# EasyEDA Pro project ConeZ-v0_1.eprj, schematic Schematic1
Board Name: Board1; Create Date: 2025-06-20; Page Name: P1; Project Name: ConeZ-12V; Schematic Name: Schematic1; Update Date: 2025-06-19; Company: EasyEDA.com; Page Size: A4; Version: V1.0
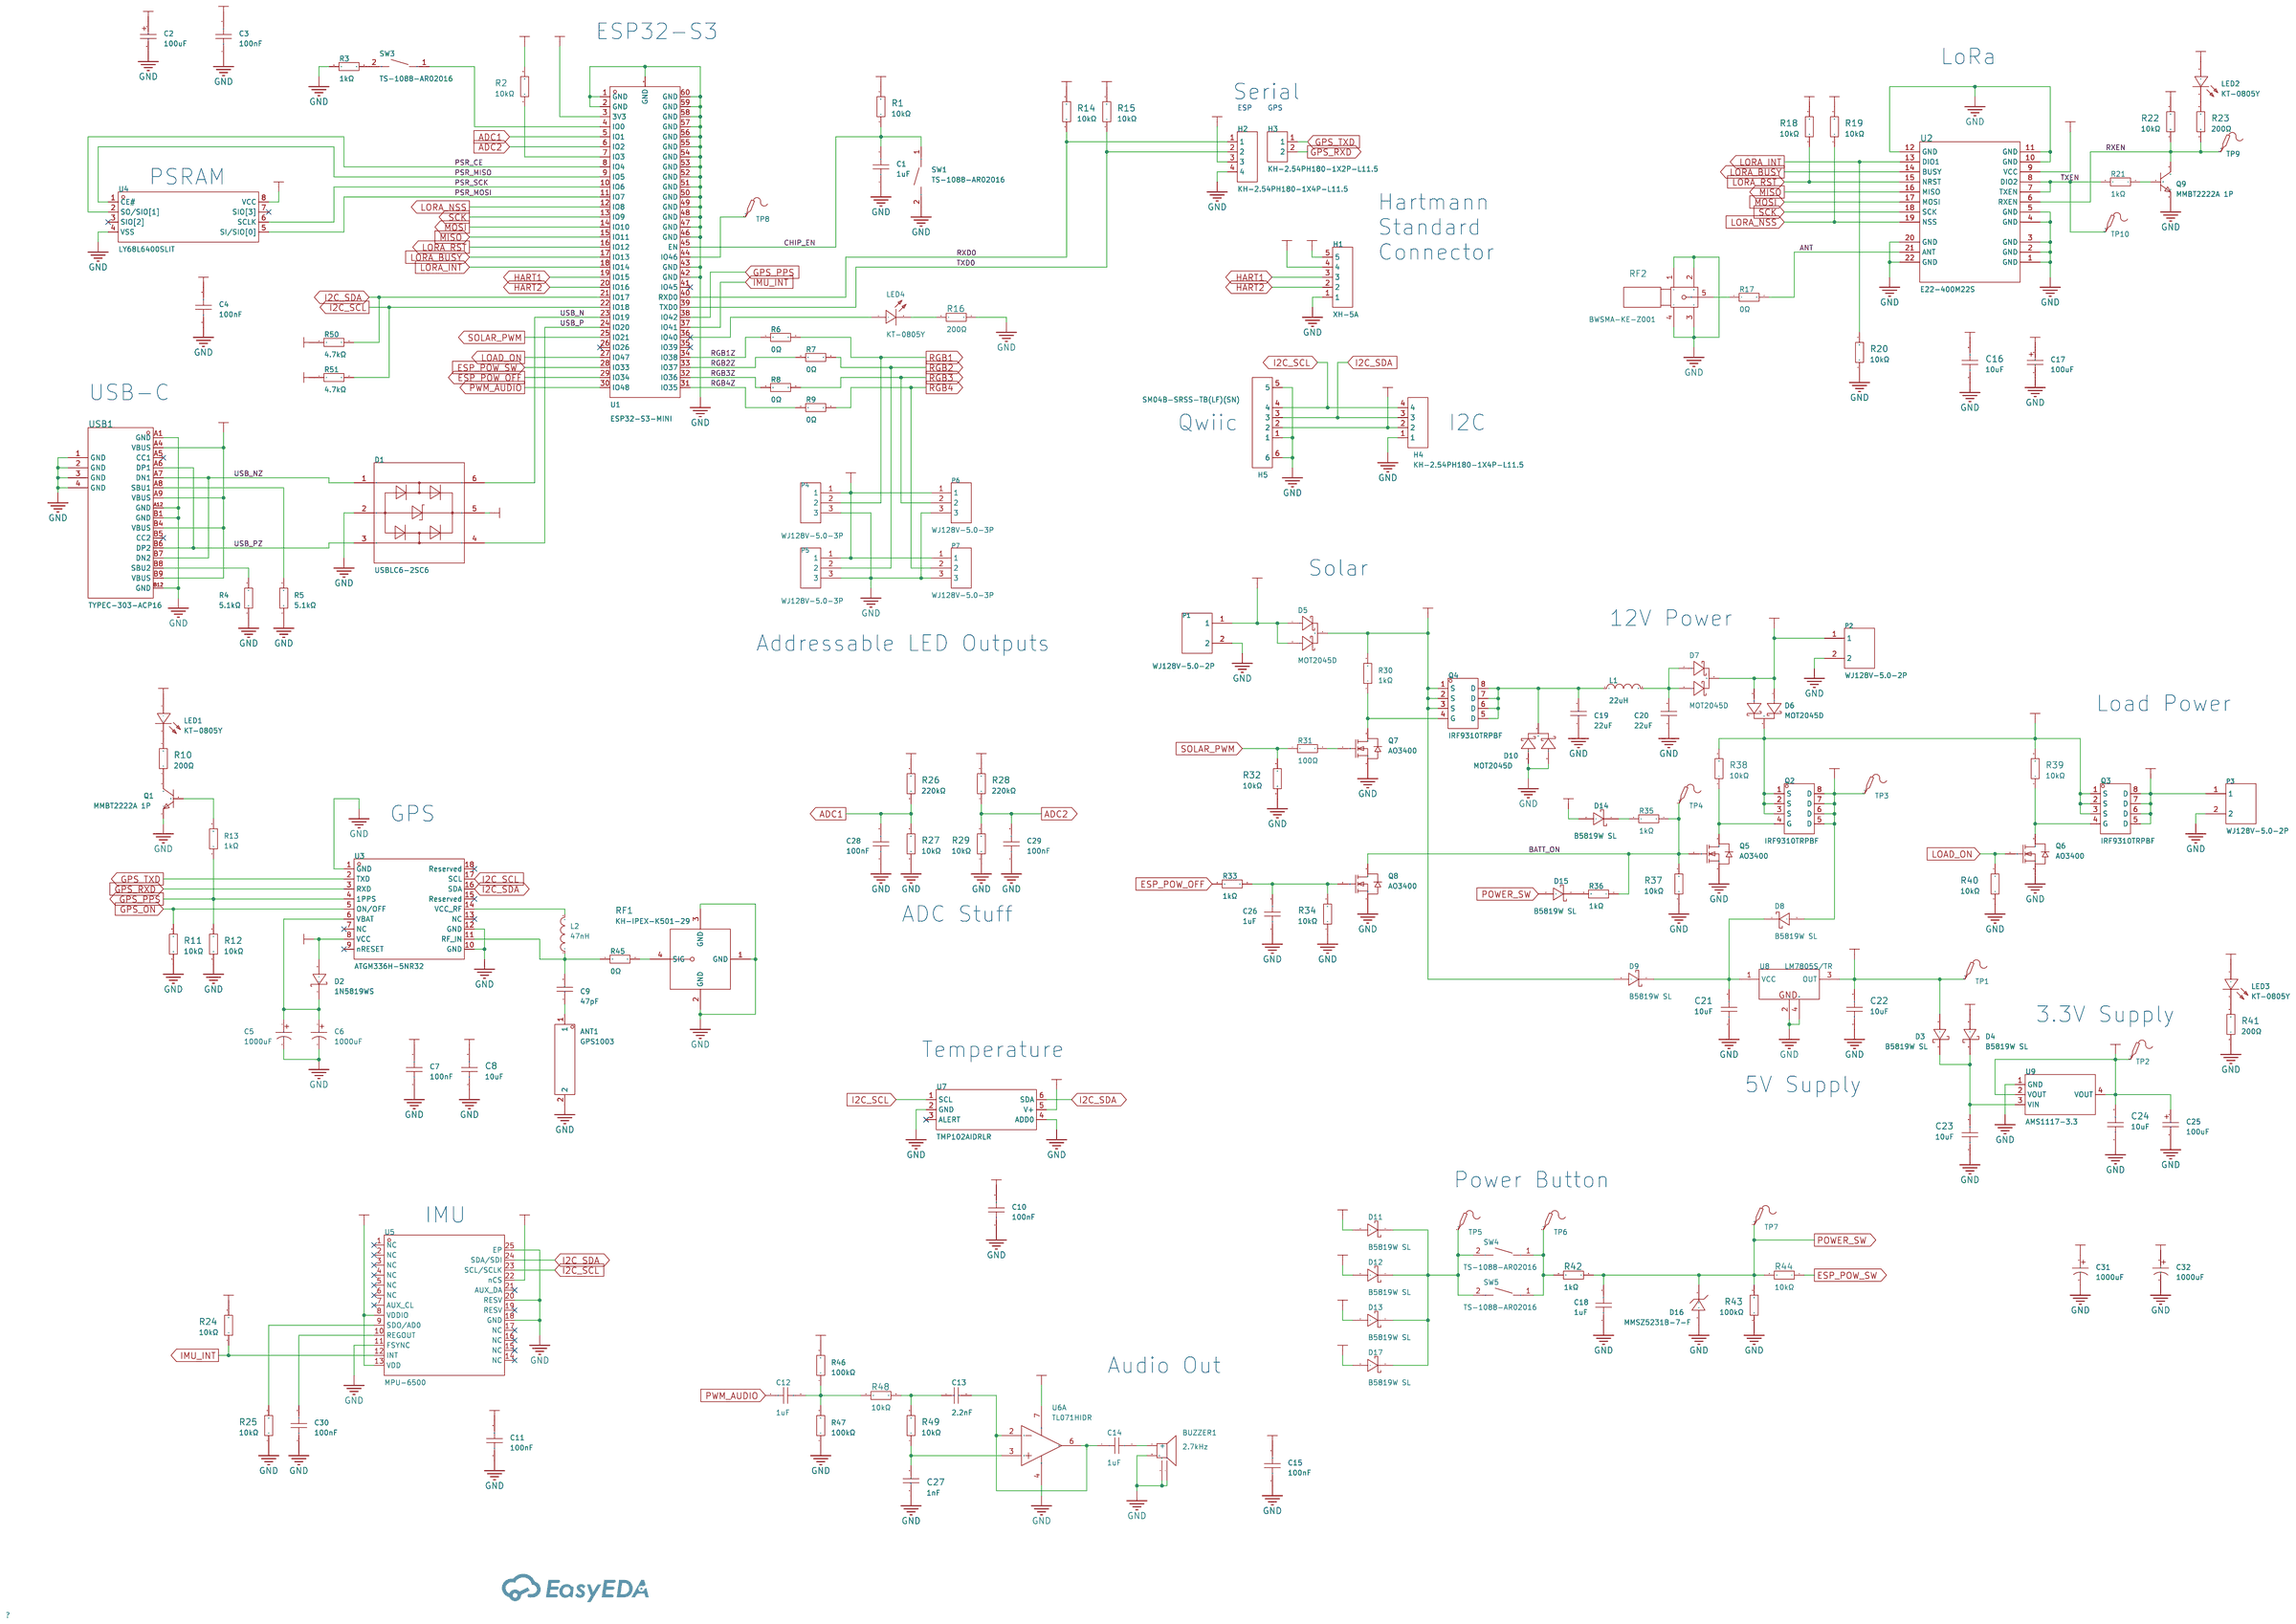
[diagram p0: schematic sheet]

## Parts
ANT1  GPS1003  [ANT-SMD_L10.0-W3.0]
BUZZER1  2.7kHz  [BUZ-SMD_4P-L8.5-W8.5-P8.50-BR]
C1  1uF  [C0603]
C2  100uF  [CASE-B_3528]
C3  100nF  [C0603]
C4  100nF  [C0603]
C5  1000uF  [CAP-SMD_BD8.0-L8.3-W8.3-FD]
C6  1000uF  [CAP-SMD_BD8.0-L8.3-W8.3-FD]
C7  100nF  [C0603]
C8  10uF  [C0603]
C9  47pF  [C0603]
C10  100nF  [C0603]
C11  100nF  [C0603]
C12  1uF  [C0603]
C13  2.2nF  [C0603]
C14  1uF  [C0603]
C15  100nF  [C0603]
C16  10uF  [C0603]
C17  100uF  [CASE-B_3528]
C18  1uF  [C0603]
C19  22uF  [C1206]
C20  22uF  [C1206]
C21  10uF  [C0603]
C22  10uF  [C0603]
C23  10uF  [C0603]
C24  10uF  [C0603]
C25  100uF  [CASE-B_3528]
C26  1uF  [C0603]
C27  1nF  [C0603]
C28  100nF  [C0603]
C29  100nF  [C0603]
C30  100nF  [C0603]
C31  1000uF  [CAP-SMD_BD8.0-L8.3-W8.3-FD]
C32  1000uF  [CAP-SMD_BD8.0-L8.3-W8.3-FD]
D1  USBLC6-2SC6  [SOT-23-6_L2.9-W1.6-P0.95-LS2.8-BL]
D2  1N5819WS  [SOD-323_L1.8-W1.3-LS2.5-RD]
D3  B5819W SL  [SOD-123_L2.7-W1.6-LS3.7-RD-1]
D4  B5819W SL  [SOD-123_L2.7-W1.6-LS3.7-RD-1]
D5  MOT2045D  [TO-252-2_L6.6-W6.1-P4.57-LS10.0-BR-CW]
D6  MOT2045D  [TO-252-2_L6.6-W6.1-P4.57-LS10.0-BR-CW]
D7  MOT2045D  [TO-252-2_L6.6-W6.1-P4.57-LS10.0-BR-CW]
D8  B5819W SL  [SOD-123_L2.7-W1.6-LS3.7-RD-1]
D9  B5819W SL  [SOD-123_L2.7-W1.6-LS3.7-RD-1]
D10  MOT2045D  [TO-252-2_L6.6-W6.1-P4.57-LS10.0-BR-CW]
D11  B5819W SL  [SOD-123_L2.7-W1.6-LS3.7-RD-1]
D12  B5819W SL  [SOD-123_L2.7-W1.6-LS3.7-RD-1]
D13  B5819W SL  [SOD-123_L2.7-W1.6-LS3.7-RD-1]
D14  B5819W SL  [SOD-123_L2.7-W1.6-LS3.7-RD-1]
D15  B5819W SL  [SOD-123_L2.7-W1.6-LS3.7-RD-1]
D16  MMSZ5231B-7-F  [SOD-123_L2.8-W1.8-LS3.7-RD]
D17  B5819W SL  [SOD-123_L2.7-W1.6-LS3.7-RD-1]
H1  XH-5A  [CONN-TH_5P-P2.50_XH-5A_C2318]
H2  KH-2.54PH180-1X4P-L11.5  [HDR-TH_4P-P2.54-V-M]
H3  KH-2.54PH180-1X2P-L11.5  [HDR-TH_2P-P2.54-V-M]
H4  KH-2.54PH180-1X4P-L11.5  [HDR-TH_4P-P2.54-V-M]
H5  SM04B-SRSS-TB(LF)(SN)  [CONN-SMD_4P-P1.00_SM04B-SRSS-TB-LF-SN]
L1  22uH  [IND-SMD_L17.5-W17.0_YXMAC1770]
L2  47nH  [L0603]
LED1  KT-0805Y  [LED0805-R-RD]
LED2  KT-0805Y  [LED0805-R-RD]
LED3  KT-0805Y  [LED0805-R-RD]
LED4  KT-0805Y  [LED0805-R-RD]
P1  WJ128V-5.0-2P  [CONN-TH_2P-P5.00_WJ128V-5.0-2P]
P2  WJ128V-5.0-2P  [CONN-TH_2P-P5.00_WJ128V-5.0-2P]
P3  WJ128V-5.0-2P  [CONN-TH_2P-P5.00_WJ128V-5.0-2P]
P4  WJ128V-5.0-3P  [CONN-TH_3P-P5.00_WJ128V-5.0-3P]
P5  WJ128V-5.0-3P  [CONN-TH_3P-P5.00_WJ128V-5.0-3P]
P6  WJ128V-5.0-3P  [CONN-TH_3P-P5.00_WJ128V-5.0-3P]
P7  WJ128V-5.0-3P  [CONN-TH_3P-P5.00_WJ128V-5.0-3P]
Q1  MMBT2222A 1P  [SOT-23-3_L2.9-W1.3-P1.90-LS2.4-BR]
Q2  IRF9310TRPBF  [SOIC-8_L4.9-W3.9-P1.27-LS6.0-BL]
Q3  IRF9310TRPBF  [SOIC-8_L4.9-W3.9-P1.27-LS6.0-BL]
Q4  IRF9310TRPBF  [SOIC-8_L4.9-W3.9-P1.27-LS6.0-BL]
Q5  AO3400  [SOT-23_L2.9-W1.3-P1.90-LS2.4-BR]
Q6  AO3400  [SOT-23_L2.9-W1.3-P1.90-LS2.4-BR]
Q7  AO3400  [SOT-23_L2.9-W1.3-P1.90-LS2.4-BR]
Q8  AO3400  [SOT-23_L2.9-W1.3-P1.90-LS2.4-BR]
Q9  MMBT2222A 1P  [SOT-23-3_L2.9-W1.3-P1.90-LS2.4-BR]
R1  10kΩ  [R0603]
R2  10kΩ  [R0603]
R3  1kΩ  [R0603]
R4  5.1kΩ  [R0603]
R5  5.1kΩ  [R0603]
R6  0Ω  [R0603]
R7  0Ω  [R0603]
R8  0Ω  [R0603]
R9  0Ω  [R0603]
R10  200Ω  [R0603]
R11  10kΩ  [R0603]
R12  10kΩ  [R0603]
R13  1kΩ  [R0603]
R14  10kΩ  [R0603]
R15  10kΩ  [R0603]
R16  200Ω  [R0603]
R17  0Ω  [R0603]
R18  10kΩ  [R0603]
R19  10kΩ  [R0603]
R20  10kΩ  [R0603]
R21  1kΩ  [R0603]
R22  10kΩ  [R0603]
R23  200Ω  [R0603]
R24  10kΩ  [R0603]
R25  10kΩ  [R0603]
R26  220kΩ  [R0603]
R27  10kΩ  [R0603]
R28  220kΩ  [R0603]
R29  10kΩ  [R0603]
R30  1kΩ  [R0603]
R31  100Ω  [R0603]
R32  10kΩ  [R0603]
R33  1kΩ  [R0603]
R34  10kΩ  [R0603]
R35  1kΩ  [R0603]
R36  1kΩ  [R0603]
R37  10kΩ  [R0603]
R38  10kΩ  [R0603]
R39  10kΩ  [R0603]
R40  10kΩ  [R0603]
R41  200Ω  [R0603]
R42  1kΩ  [R0603]
R43  100kΩ  [R0603]
R44  10kΩ  [R0603]
R45  0Ω  [R0603]
R46  100kΩ  [R0603]
R47  100kΩ  [R0603]
R48  10kΩ  [R0603]
R49  10kΩ  [R0603]
R50  4.7kΩ  [R0603]
R51  4.7kΩ  [R0603]
RF1  KH-IPEX-K501-29  [ANT-SMD_KH-IPEX-K501-29]
RF2  BWSMA-KE-Z001  [SMA-TH_BWSMA-KE-Z001]
SW1  TS-1088-AR02016  [SW-SMD_L3.9-W3.0-P4.45]
SW3  TS-1088-AR02016  [SW-SMD_L3.9-W3.0-P4.45]
SW4  TS-1088-AR02016  [SW-SMD_L3.9-W3.0-P4.45]
SW5  TS-1088-AR02016  [SW-SMD_L3.9-W3.0-P4.45]  (no BOM)
TP1  -  [Test-Point-0.5mm]
TP2  -  [Test-Point-0.5mm]
TP3  -  [Test-Point-0.5mm]
TP4  -  [Test-Point-0.5mm]
TP5  -  [Test-Point-0.5mm]
TP6  -  [Test-Point-0.5mm]
TP7  -  [Test-Point-0.5mm]
TP8  -  [Test-Point-0.5mm]
TP9  -  [Test-Point-0.5mm]
TP10  -  [Test-Point-0.5mm]
U1  ESP32-S3-MINI  [BULETM-SMD_ESP32-S3-MINI-1-N8]
U2  E22-400M22S  [WIRELM-SMD_E22-400M22S]
U3  ATGM336H-5NR32  [GPS-SMD_18P-L10.1-W9.7-P1.10-TL]
U4  LY68L6400SLIT  [SOP-8_L4.9-W3.9-P1.27-LS6.0-BL]
U5  MPU-6500  [QFN-24_L3.0-W3.0-P0.40-BL-EP]
U6  TL071HIDR  [SOIC-8_L4.9-W3.9-P1.27-LS6.0-BL]  (section 1)
U7  TMP102AIDRLR  [SOT-563_L1.6-W1.2-P0.50-LS1.6-BR]
U8  LM7805S/TR  [TO-263-3_L8.6-W10.2-P2.54-LS14.4-BR]
U9  AMS1117-3.3  [SOT-223-3_L6.5-W3.4-P2.30-LS7.0-BR]
USB1  TYPEC-303-ACP16  [USB-C-SMD_TYPEC-303-ACP16]

## Library data of the parts
ANT1 = GPS1003: Supplier Part: C239243; Manufacturer: rainsun(霖昱微); Supplier Footprint: SMD; JLCPCB Part Class: Extended Part; Datasheet: https://atta.szlcsc.com/upload/public/pdf/source/20180730/C239243_D9C604229B673F18F0675B95D946C54C.pdf; Supplier: LCSC
BUZZER1 = MLT-8530: Driver Circuitry:Passive (external drive) Technology:Electromagnetic Type Voltage - Supply:2.5V~4.5V Voltage - Supply:2.5V~4.5V Frequency:2.7kHz Sound Pressure Level(SPL):80dB Length:8.5mm Width:8.5mm Height:3.3mm; Supplier Part: C94599; Manufacturer: 华能; Supplier Footprint: SMD,8.5x8.5mm; JLCPCB Part Class: Extended Part; Datasheet: https://atta.szlcsc.com/upload/public/pdf/source/20170522/1495448322339.pdf; Supplier: LCSC; Driver Circuitry: Passive (external drive); Technology: Electromagnetic Type; Voltage - Supply: 2.5V~4.5V; Sound Pressure Level(SPL): 80dB; Length: 8.5mm; Width: 8.5mm; Height: 3.3mm
C1 C12 C14 C18 C26 = CL10A105KB8NNNC: Capacitance: Tolerance:±10% Tolerance:±10% Voltage Rated: Temperature Coefficient:; LCSC Part Name: 1uF ±10% 50V; Supplier Part: C15849; Manufacturer: SAMSUNG(三星); Supplier Footprint: 0603; JLCPCB Part Class: Basic Part; Datasheet: https://atta.szlcsc.com/upload/public/pdf/source/20160218/1457707763339.pdf; Supplier: LCSC; Tolerance: ±10%
C2 C17 C25 = TAJB107K006RNJ: LCSC Part Name: 100uF ±10% 6.3V; Supplier Part: C16133; Manufacturer: Kyocera AVX; Supplier Footprint: CASE-B-3528-21(mm); JLCPCB Part Class: Basic Part; Supplier: LCSC; Tolerance: ±10%; Voltage Rating: 6.3V; Equivalent Series Resistance(ESR): 1.7Ω@100kHz; Operating Temperature: -55℃~+125℃
C3 C4 C7 C10 C11 C15 C28-C30 = CC0603KRX7R9BB104: Capacitance:100nF Tolerance:±10% Tolerance:±10% Voltage Rating:50V Temperature Coefficient:X7R; LCSC Part Name: 100nF ±10% 50V; Supplier Part: C14663; Manufacturer: YAGEO(国巨); Supplier Footprint: 0603; JLCPCB Part Class: Basic Part; Datasheet: https://atta.szlcsc.com/upload/public/pdf/source/20180910/C282072_33301C7F631E79921B82A8DAC6BCC5B3.pdf; Supplier: LCSC; Tolerance: ±10%; Voltage Rating: 50V; Temperature Coefficient: X7R
C5 C6 C31 C32 = RVT0J102M0810: Capacitance:1000uF Tolerance:±20% Tolerance:±20% Voltage Rating:6.3V Ripple Current:- Equivalent Series Resistance(ESR):- Diameter:8mm Height - Seated (Max):10.2mm Lifetime:2000hrs@105℃ Operating Temperature:-55℃~+105℃ Operating Temperature:-55℃~+105℃; LCSC Part Name: 1000uF ±20% 6.3V; Supplier Part: C42851; Manufacturer: HONOR(荣誉); Supplier Footprint: SMD,D8xL10.5mm; JLCPCB Part Class: Extended Part; Datasheet: https://atta.szlcsc.com/upload/public/pdf/source/20250304/8AEF5A10740A8CC68A04B0B0B1D3A755.pdf; Supplier: LCSC; Tolerance: ±20%; Voltage Rating: 6.3V; Diameter: 8mm; Height - Seated (Max): 10.2mm; Lifetime: 2000hrs@105℃; Operating Temperature: -55℃~+105℃
C8 C16 C21-C24 = CL10A106MA8NRNC: Capacitance: Tolerance:±20% Tolerance:±20% Voltage Rated: Temperature Coefficient:; LCSC Part Name: 10uF ±20% 25V; Supplier Part: C96446; Manufacturer: SAMSUNG(三星); Supplier Footprint: 0603; JLCPCB Part Class: Basic Part; Datasheet: https://atta.szlcsc.com/upload/public/pdf/source/20160218/1457707763339.pdf; Supplier: LCSC; Tolerance: ±20%
C9 = CL10C470JB8NNNC: Capacitance: Tolerance:±5% Tolerance:±5% Voltage Rated: Temperature Coefficient:; LCSC Part Name: 47pF ±5% 50V; Supplier Part: C1671; Manufacturer: SAMSUNG(三星); Supplier Footprint: 0603; JLCPCB Part Class: Basic Part; Datasheet: https://atta.szlcsc.com/upload/public/pdf/source/20160218/1457707763339.pdf; Supplier: LCSC; Tolerance: ±5%
C13 = 0603B222K500NT: Capacitance:2200pF Tolerance:±10% Tolerance:±10% Voltage Rating:50V Temperature Coefficient:X7R; LCSC Part Name: 2.2nF ±10% 50V; Supplier Part: C1604; Manufacturer: FH(风华); Supplier Footprint: 0603; JLCPCB Part Class: Basic Part; Datasheet: https://atta.szlcsc.com/upload/public/pdf/source/20200305/C486355_26A10D38EF8C2A5C37091D0039909270.pdf; Supplier: LCSC; Tolerance: ±10%; Voltage Rating: 50V; Temperature Coefficient: X7R
C19 C20 = CL31A226KAHNNNE: LCSC Part Name: 22uF ±10% 25V; Supplier Part: C12891; Manufacturer: SAMSUNG(三星); Supplier Footprint: 1206; JLCPCB Part Class: Basic Part; Datasheet: https://atta.szlcsc.com/upload/public/pdf/source/20160218/1457707763339.pdf; Supplier: LCSC; Tolerance: ±10%
C27 = CL10B102KB8NNNC: Capacitance: Tolerance:±10% Tolerance:±10% Voltage Rated: Temperature Coefficient:; LCSC Part Name: 1nF ±10% 50V; Supplier Part: C1588; Manufacturer: SAMSUNG(三星); Supplier Footprint: 0603; JLCPCB Part Class: Basic Part; Datasheet: https://atta.szlcsc.com/upload/public/pdf/source/20160218/1457707763339.pdf; Supplier: LCSC; Tolerance: ±10%
D1 = USBLC6-2SC6_C7519: polarity:Unidirectional Reverse Stand-Off Voltage (Vrwm):5.25V Maximum Clamping Voltage:17V Peak Pulse Current (Ipp)@10/1000us:5A Breakdown Voltage:6V Number of Lines:双路 Operating Temperature:-40℃~+125℃@(Tj) Operating Temperature:-40℃~+125℃@(Tj) Type:ESD; LCSC Part Name: 单向ESD; Supplier Part: C7519; Manufacturer: ST(意法半导体); Supplier Footprint: SOT-23-6; JLCPCB Part Class: Extended Part; Datasheet: https://atta.szlcsc.com/upload/public/pdf/source/20140724/1457707160627.pdf; Supplier: LCSC; polarity: Unidirectional; Reverse Stand-Off Voltage (Vrwm): 5.25V; Maximum Clamping Voltage: 17V; Peak Pulse Current (Ipp)@10/1000us: 5A; Breakdown Voltage: 6V; Number of Lines: 双路; Operating Temperature: -40℃~+125℃@(Tj); Type: ESD
D2 = 1N5819WS_C191023: Forward Voltage (Vf@If):600mV@1A Reverse Voltage (Vr):40V Rectified Current:1A; LCSC Part Name: 电压:40V 电流:1A; Supplier Part: C191023; Manufacturer: Hottech(合科泰); Supplier Footprint: SOD-323; JLCPCB Part Class: Basic Part; Datasheet: https://atta.szlcsc.com/upload/public/pdf/source/20220428/3CB86FD8D28D653594B4E35F9D5AEFD9.pdf; Supplier: LCSC; Forward Voltage (Vf@If): 600mV@1A; Reverse Voltage (Vr): 40V; Rectified Current: 1A
D3 D4 D8 D9 D11-D15 D17 = B5819W SL: LCSC Part Name: 电压:40V 电流:1A; Supplier Part: C8598; Manufacturer: CJ(江苏长电/长晶); Supplier Footprint: SOD-123; JLCPCB Part Class: Basic Part; Datasheet: https://atta.szlcsc.com/upload/public/pdf/source/20171228/C164911_15144413243851213914.pdf; Supplier: LCSC; Forward Voltage (Vf@If): 600mV@1A; Reverse Voltage (Vr): 40V; Rectified Current: 1A
D5-D7 D10 = MOT2045D: LCSC Part Name: 电压:45V 电流:20A; Supplier Part: C5143091; Manufacturer: MOT(仁懋); Supplier Footprint: TO-252; JLCPCB Part Class: Extended Part; Datasheet: https://atta.szlcsc.com/upload/public/pdf/source/20240219/60133ED2FF76A65570CC4AEB79F23B07.pdf; Supplier: LCSC; Forward Voltage (Vf@If): 570mV@10A; Reverse Voltage (Vr): 45V; Rectified Current: 20A; Reverse Leakage Current (Ir): 50uA@45V
D16 = MMSZ5231B-7-F: Supplier Part: C85181; Manufacturer: DIODES(美台); Supplier Footprint: SOD-123; JLCPCB Part Class: Extended Part; Datasheet: https://atta.szlcsc.com/upload/public/pdf/source/20161024/1477288742621.pdf; Supplier: LCSC; Diode Configuration: Single; Zener Voltage (Nom): 5.1V; Reverse Leakage Current (Ir): 5uA@2V; Zener Voltage (Range): 4.85V~5.36V; Power Dissipation: 500mW; Zener Impedance (Zzt): 17Ω; Tolerance: ±5%
H1 = XH-5A_C2318: Pins Structure:1x5P Pitch:2.5mm Mounting Type:Direct Insert Reference Series:XH Number of Pins:5P Number of Rows:1 Number of PINs Per Row:5 Row Spacing:- Current Rating:- Contact Material:- Contact Plating:- Operating Temperature:- Operating Temperature:-; LCSC Part Name: 1x5P 间距:2.5mm 直插 系列:XH; Supplier Part: C2318; Manufacturer: BOOMELE(博穆精密); Supplier Footprint: 插件,P=2.5mm; JLCPCB Part Class: Extended Part; Datasheet: https://atta.szlcsc.com/upload/public/pdf/source/20151222/1457707654251.pdf; Supplier: LCSC; Pins Structure: 1x5P; Pitch: 2.5mm; Mounting Type: Direct Insert; Reference Series: XH; Number of Pins: 5P; Number of Rows: 1; Number of PINs Per Row: 5
H2 H4 = KH-2.54PH180-1X4P-L11.5: Pin Structure:1x4P Pitch:2.54mm Row Spacing:- Circluar Pins/Square Pins:Policy Mounting Type:Straight Number of Rows:Single Row Number of Pins:4P Current Rating:3A Voltage Rating (Max):- Length of Mating Pin:6mm Insulation Height:2.5mm Length of End Conne; LCSC Part Name: 1x4P 间距:2.54mm 方针 直插; Supplier Part: C2905435; Manufacturer: kinghelm(金航标); Supplier Footprint: 插件,P=2.54mm; JLCPCB Part Class: Extended Part; Datasheet: https://atta.szlcsc.com/upload/public/pdf/source/20211019/06FD9EA041E66F176E900F61FE678D35.pdf; Supplier: LCSC; Pin Structure: 1x4P; Pitch: 2.54mm; Circluar Pins/Square Pins: Policy; Mounting Type: Straight; Number of Rows: Single Row; Number of Pins: 4P; Current Rating: 3A; Length of Mating Pin: 6mm; Insulation Height: 2.5mm; Length of End Connection Pin: 3mm; Operating Temperature: -40℃~+105℃; Color: Black
H3 = KH-2.54PH180-1X2P-L11.5: Pin Structure:1x2P Pitch:2.54mm Row Spacing:- Circluar Pins/Square Pins:Policy Mounting Type:Straight Number of Rows:Single Row Number of Pins:2P Current Rating:3A Voltage Rating (Max):- Length of Mating Pin:6mm Insulation Height:2.5mm Length of End Conne; LCSC Part Name: 1x2P 间距:2.54mm 方针 直插; Supplier Part: C2905434; Manufacturer: kinghelm(金航标); Supplier Footprint: 插件,P=2.54mm; JLCPCB Part Class: Extended Part; Datasheet: https://atta.szlcsc.com/upload/public/pdf/source/20211019/75EAF9E0823F75B5BB441C07BAE9F5E6.pdf; Supplier: LCSC; Pin Structure: 1x2P; Pitch: 2.54mm; Circluar Pins/Square Pins: Policy; Mounting Type: Straight; Number of Rows: Single Row; Number of Pins: 2P; Current Rating: 3A; Length of Mating Pin: 6mm; Insulation Height: 2.5mm; Length of End Connection Pin: 3mm; Operating Temperature: -40℃~+105℃; Color: Black
H5 = SM04B-SRSS-TB(LF)(SN): Pins Structure:1x4P Pitch:1mm Mounting Style:Horizontal attachment Reference Series:SH Number of Pins:4P Number of Rows:1 Number of PINs Per Row:4 Row Spacing:- Current Rating (Max):1A Contact Material:Copper alloy Contact Plating:Tin Operating Temperatur; LCSC Part Name: 1x4P 间距:1mm 卧贴 系列:SH; Supplier Part: C160404; Manufacturer: JST; Supplier Footprint: SMD,P=1mm,卧贴; JLCPCB Part Class: Extended Part; Datasheet: https://atta.szlcsc.com/upload/public/pdf/source/20181010/C265335_7D2AD766CA0E20E745663C87507A223E.pdf; Supplier: LCSC; Pins Structure: 1x4P; Pitch: 1mm; Mounting Style: Horizontal attachment; Reference Series: SH; Number of Pins: 4P; Number of Rows: 1; Number of PINs Per Row: 4; Current Rating (Max): 1A; Contact Material: Copper alloy; Contact Plating: Tin; Operating Temperature Range: -25℃~+85℃; Rated Voltage (Max): 50V; Plastic Material: PA; Flame Retardant Rating: UL94V-0; Supplementary Features: Auxiliary soldering legs; Colour: White; Z-Height of the Board: 2.9mm; X-Length of Bottom Edge on Board (Spacing Line): 6mm; Y-Width of Bottom Edge on Board: 4.32mm
L1 = TMPA1707SP-220MN-D: LCSC Part Name: 22uH ±20% 11.5A; Supplier Part: C357120; Manufacturer: TAI-TECH(台庆); Supplier Footprint: SMD,17.8x16.9mm; JLCPCB Part Class: Extended Part; Datasheet: https://atta.szlcsc.com/upload/public/pdf/source/20200917/C357120_9D58EA066CA46378720E79A8B67C82ED.pdf; Supplier: LCSC; Tolerance: ±20%; Saturation Current (Isat): 11.5A
L2 = VHF160808H47NJT: Inductance: Tolerance:±5% Tolerance:±5% Rated Current: Saturation Current (Isat):- DC Resistance (DCR): Q @ Freq:- Frequency - Self Resonant:- Ratings:; LCSC Part Name: 47nH ±5%; Supplier Part: C90210; Manufacturer: FH(风华); Supplier Footprint: 0603; JLCPCB Part Class: Extended Part; Datasheet: https://atta.szlcsc.com/upload/public/pdf/source/20230223/8EF545BE87E825DABED9AF3380ABCE94.pdf; Supplier: LCSC; Tolerance: ±5%
LED1-LED4 = KT-0805Y: Emitted Color:Yellow Power Dissipation:- Forward Current:- Dominant Wavelength:- Dominant Wavelength:- Peak Wavelength:- Diode Configuration:- Lens Color:- Color Temperature:- Color Temperature:- Viewing Angle:- Mounting Sytle:- Operating Temperature:- Op; LCSC Part Name: 0805 黄灯 高亮; Supplier Part: C2296; Manufacturer: KENTO; Supplier Footprint: 0805; JLCPCB Part Class: Basic Part; Datasheet: https://atta.szlcsc.com/upload/public/pdf/source/20160421/1461205044170.pdf; Supplier: LCSC; Emitted Color: Yellow
P1-P3 = WJ128V-5.0-2P: LCSC Part Name: 5mm 1x2P 排数:1 每排P数:2 直插; Supplier Part: C8269; Manufacturer: KANGNEX(康奈克斯电气); Supplier Footprint: 插件,P=5mm; JLCPCB Part Class: Extended Part; Datasheet: https://atta.szlcsc.com/upload/public/pdf/source/20191225/C8269_1FF44D6D2E83DB14A7CA266A410FD9AD.pdf; Supplier: LCSC; Structure: 1x2P; Pitch: 5mm; Color: Green; Mounting Style: Straight; Current Rating (Max): 20A; Voltage Rating (Max): 250V; Number of Pins: 2P; Number of Rows: 1; Wire Gauge - AWG: 12~22; Wire Gauge - mm2: 2.5; Number of PINs Per Row: 2; Operating Temperature Range: -40℃~+105℃
P4-P7 = WJ128V-5.0-3P: LCSC Part Name: 5mm 1x3P 排数:1 每排P数:3 直插; Supplier Part: C8270; Manufacturer: KANGNEX(康奈克斯电气); Supplier Footprint: 插件,P=5mm; JLCPCB Part Class: Extended Part; Datasheet: https://atta.szlcsc.com/upload/public/pdf/source/20191225/C8270_68EE597E4523D77F257225C74F324861.pdf; Supplier: LCSC; Structure: 1x3P; Pitch: 5mm; Color: Green; Mounting Style: Straight; Current Rating (Max): 20A; Voltage Rating (Max): 250V; Number of Pins: 3P; Number of Rows: 1; Wire Gauge - AWG: 12~22; Wire Gauge - mm2: 2.5; Number of PINs Per Row: 3; Operating Temperature Range: -40℃~+105℃
Q1 Q9 = MMBT2222A 1P: type:NPN Current - Collector(Ic): Collector - Emitter Voltage VCEO:40V Pd - Power Dissipation:300mW DC Current Gain:100@150mA,10V DC Current Gain:100@150mA,10V Transition frequency(fT):300MHz Current - Collector Cutoff:10nA Vce Saturation(VCE(sat)):- Oper; LCSC Part Name: 丝印1P; Supplier Part: C8512; Manufacturer: CJ(江苏长电/长晶); Supplier Footprint: SOT-23; JLCPCB Part Class: Basic Part; Datasheet: https://atta.szlcsc.com/upload/public/pdf/source/20140815/1457707223705.pdf; Supplier: LCSC; type: NPN; Collector - Emitter Voltage VCEO: 40V; Pd - Power Dissipation: 300mW; DC Current Gain: 100@150mA,10V; Transition frequency(fT): 300MHz; Current - Collector Cutoff: 10nA; Operating Temperature: -55℃~+150℃
Q2-Q4 = IRF9310TRPBF: Type:1 Piece P-Channel Drain Source Voltage (Vdss): Continuous Drain Current (Id): Drain Source On Resistance (RDS(on)@Vgs,Id):4.6mΩ@10V,20A Power Dissipation (Pd): Gate Threshold Voltage (Vgs(th)@Id):2.4V@100uA Total Gate Charge (Qg@Vgs):165nC@10V Input; LCSC Part Name: 1个P沟道 耐压:30V 电流:20A; Supplier Part: C92305; Manufacturer: Infineon(英飞凌); Supplier Footprint: SOIC-8-150mil; JLCPCB Part Class: Extended Part; Datasheet: https://atta.szlcsc.com/upload/public/pdf/source/20180125/C92305_15168617672981301964.pdf; Supplier: LCSC; Type: 1 Piece P-Channel; Drain Source On Resistance (RDS(on)@Vgs,Id): 4.6mΩ@10V,20A; Gate Threshold Voltage (Vgs(th)@Id): 2.4V@100uA; Total Gate Charge (Qg@Vgs): 165nC@10V; Input Capacitance (Ciss@Vds): 5.25nF@15V; Operating Temperature: -55℃~+150℃@(Tj)
Q5-Q8 = AO3400_C2938367: LCSC Part Name: 1个N沟道 耐压:30V 电流:5.8A; Supplier Part: C2938367; Manufacturer: GOODWORK(固得沃克); Supplier Footprint: SOT-23; JLCPCB Part Class: Extended Part; Datasheet: https://atta.szlcsc.com/upload/public/pdf/source/20240805/AF56525E67E43DBB802F95DDDF058BE9.pdf; Supplier: LCSC; Type: 1 N-channel; Drain to Source Voltage: 30V; Current - Continuous Drain(Id): 5.8A; RDS(on): 52mΩ@2.5V,4A; Pd - Power Dissipation: 1.5W; Gate Threshold Voltage (Vgs(th)@Id): 700mV; Input Capacitance(Ciss@Vds): 1.05nF; Reverse Transfer Capacitance (Crss@Vds): 77pF; Operating Temperature: -55℃~+150℃
R1 R2 R11 R12 R14 R15 R18-R20 R22 R24 R25 R27 R29 R32 R34 R37-R40 R44 R48 R49 = 0603WAF1002T5E: Type:Thick Film Resistors Resistance:10kΩ Tolerance:±1% Tolerance:±1% Power(Watts): Overload Voltage (Max): Temperature Coefficient:±100ppm/℃ Temperature Coefficient:±100ppm/℃ Operating Temperature Range:-55℃~+155℃ Operating Temperature Range:-55℃~+155℃; LCSC Part Name: 厚膜电阻 10kΩ ±1% 100mW; Supplier Part: C25804; Manufacturer: UNI-ROYAL(厚声); Supplier Footprint: 0603; JLCPCB Part Class: Basic Part; Datasheet: https://atta.szlcsc.com/upload/public/pdf/source/20200306/C422600_1E6D84923E4A46A82E41ADD87F860B5C.pdf; Supplier: LCSC; Type: Thick Film Resistors; Tolerance: ±1%; Temperature Coefficient: ±100ppm/℃; Operating Temperature Range: -55℃~+155℃
R3 R13 R21 R30 R33 R35 R36 R42 = 0603WAF1001T5E: Type:Thick Film Resistors Resistance:1kΩ Tolerance:±1% Tolerance:±1% Power(Watts): Overload Voltage (Max): Temperature Coefficient:±100ppm/℃ Temperature Coefficient:±100ppm/℃ Operating Temperature Range:-55℃~+155℃ Operating Temperature Range:-55℃~+155℃; LCSC Part Name: 1kΩ ±1% 100mW 厚膜电阻; Supplier Part: C21190; Manufacturer: UNI-ROYAL(厚声); Supplier Footprint: 0603; JLCPCB Part Class: Basic Part; Datasheet: https://atta.szlcsc.com/upload/public/pdf/source/20200306/C422600_1E6D84923E4A46A82E41ADD87F860B5C.pdf; Supplier: LCSC; Type: Thick Film Resistors; Tolerance: ±1%; Temperature Coefficient: ±100ppm/℃; Operating Temperature Range: -55℃~+155℃
R4 R5 = 0603WAF5101T5E: Type:Thick Film Resistors Resistance:5.1kΩ Tolerance:±1% Tolerance:±1% Power(Watts): Overload Voltage (Max): Temperature Coefficient:±100ppm/℃ Temperature Coefficient:±100ppm/℃ Operating Temperature Range:-55℃~+155℃ Operating Temperature Range:-55℃~+155℃; LCSC Part Name: 5.1kΩ ±1% 100mW 厚膜电阻; Supplier Part: C23186; Manufacturer: UNI-ROYAL(厚声); Supplier Footprint: 0603; JLCPCB Part Class: Basic Part; Datasheet: https://atta.szlcsc.com/upload/public/pdf/source/20200306/C422600_1E6D84923E4A46A82E41ADD87F860B5C.pdf; Supplier: LCSC; Type: Thick Film Resistors; Tolerance: ±1%; Temperature Coefficient: ±100ppm/℃; Operating Temperature Range: -55℃~+155℃
R6-R9 R17 R45 = 0603WAF0000T5E: Type:Thick Film Resistors Resistance: Tolerance:±1% Tolerance:±1% Power(Watts): Overload Voltage (Max): Operating Temperature Range:-55℃~+155℃ Operating Temperature Range:-55℃~+155℃; LCSC Part Name: 0Ω ±1% 100mW 厚膜电阻; Supplier Part: C21189; Manufacturer: UNI-ROYAL(厚声); Supplier Footprint: 0603; JLCPCB Part Class: Basic Part; Datasheet: https://atta.szlcsc.com/upload/public/pdf/source/20200306/C422600_1E6D84923E4A46A82E41ADD87F860B5C.pdf; Supplier: LCSC; Type: Thick Film Resistors; Tolerance: ±1%; Operating Temperature Range: -55℃~+155℃
R10 R16 R23 R41 = 0603WAF2000T5E: Type:Thick Film Resistors Resistance: Tolerance:±1% Tolerance:±1% Power(Watts): Overload Voltage (Max): Temperature Coefficient:±100ppm/℃ Temperature Coefficient:±100ppm/℃ Operating Temperature Range:-55℃~+155℃ Operating Temperature Range:-55℃~+155℃; LCSC Part Name: 200Ω ±1% 100mW 厚膜电阻; Supplier Part: C8218; Manufacturer: UNI-ROYAL(厚声); Supplier Footprint: 0603; JLCPCB Part Class: Basic Part; Datasheet: https://atta.szlcsc.com/upload/public/pdf/source/20200306/C422600_1E6D84923E4A46A82E41ADD87F860B5C.pdf; Supplier: LCSC; Type: Thick Film Resistors; Tolerance: ±1%; Temperature Coefficient: ±100ppm/℃; Operating Temperature Range: -55℃~+155℃
R26 R28 = 0603WAF2203T5E: LCSC Part Name: 220kΩ ±1% 100mW 厚膜电阻; Supplier Part: C22961; Manufacturer: UNI-ROYAL(厚声); Supplier Footprint: 0603; JLCPCB Part Class: Basic Part; Datasheet: https://atta.szlcsc.com/upload/public/pdf/source/20200306/C422600_1E6D84923E4A46A82E41ADD87F860B5C.pdf; Supplier: LCSC; Type: Thick Film Resistors; Tolerance: ±1%; Temperature Coefficient: ±100ppm/℃; Operating Temperature Range: -55℃~+155℃
R31 = 0603WAF1000T5E: LCSC Part Name: 100Ω ±1% 100mW 厚膜电阻; Supplier Part: C22775; Manufacturer: UNI-ROYAL(厚声); Supplier Footprint: 0603; JLCPCB Part Class: Basic Part; Datasheet: https://atta.szlcsc.com/upload/public/pdf/source/20200306/C422600_1E6D84923E4A46A82E41ADD87F860B5C.pdf; Supplier: LCSC; Type: Thick Film Resistors; Tolerance: ±1%; Temperature Coefficient: ±200ppm/℃; Operating Temperature Range: -55℃~+155℃
R43 R46 R47 = 0603WAF1003T5E: Type:Thick Film Resistors Resistance:100kΩ Tolerance:±1% Tolerance:±1% Power(Watts): Overload Voltage (Max): Temperature Coefficient:±100ppm/℃ Temperature Coefficient:±100ppm/℃ Operating Temperature Range:-55℃~+155℃ Operating Temperature Range:-55℃~+155℃; LCSC Part Name: 100kΩ ±1% 100mW 厚膜电阻; Supplier Part: C25803; Manufacturer: UNI-ROYAL(厚声); Supplier Footprint: 0603; JLCPCB Part Class: Basic Part; Datasheet: https://atta.szlcsc.com/upload/public/pdf/source/20200306/C422600_1E6D84923E4A46A82E41ADD87F860B5C.pdf; Supplier: LCSC; Type: Thick Film Resistors; Tolerance: ±1%; Temperature Coefficient: ±100ppm/℃; Operating Temperature Range: -55℃~+155℃
R50 R51 = 0603WAF4701T5E: Type:Thick Film Resistors Resistance:4.7kΩ Tolerance:±1% Tolerance:±1% Power(Watts): Overload Voltage (Max): Temperature Coefficient:±100ppm/℃ Temperature Coefficient:±100ppm/℃ Operating Temperature Range:-55℃~+155℃ Operating Temperature Range:-55℃~+155℃; LCSC Part Name: 4.7kΩ ±1% 100mW 厚膜电阻; Supplier Part: C23162; Manufacturer: UNI-ROYAL(厚声); Supplier Footprint: 0603; JLCPCB Part Class: Basic Part; Datasheet: https://atta.szlcsc.com/upload/public/pdf/source/20200306/C422600_1E6D84923E4A46A82E41ADD87F860B5C.pdf; Supplier: LCSC; Type: Thick Film Resistors; Tolerance: ±1%; Temperature Coefficient: ±100ppm/℃; Operating Temperature Range: -55℃~+155℃
RF1 = KH-IPEX-K501-29: Connector Type:板端 Interface Type:内针 Number of Ports:1 Interface Diameter:2mm Interface Length/Height:1.25mm Frequency-Max:3GHz RF Series:IPEX Impedance:50Ω Style:- Operating Temperature Range:-40℃~+90℃ Operating Temperature Range:-40℃~+90℃; LCSC Part Name: IPEX 内针; Supplier Part: C411563; Manufacturer: kinghelm(金航标); Supplier Footprint: SMD; JLCPCB Part Class: Extended Part; Datasheet: https://atta.szlcsc.com/upload/public/pdf/source/20220620/3534C43453AFDE5147CC743E04DB9A56.pdf; Supplier: LCSC; Connector Type: 板端; Interface Type: 内针; Number of Ports: 1; Interface Diameter: 2mm; Interface Length/Height: 1.25mm; Frequency-Max: 3GHz; RF Series: IPEX; Impedance: 50Ω; Operating Temperature Range: -40℃~+90℃
RF2 = BWSMA-KE-Z001_C496549: LCSC Part Name: 内孔 SMA 正脚; Supplier Part: C496549; Manufacturer: BAT WIRELESS(蝙蝠无线); Supplier Footprint: 插件; JLCPCB Part Class: Extended Part; Datasheet: https://atta.szlcsc.com/upload/public/pdf/source/20221228/40BF41E56A06003A0210E1785CA66EA6.pdf; Supplier: LCSC; Connector Type: 板端; Interface Type: 内孔; Number of Ports: 1; RF Series: SMA; Impedance: 50Ω; Style: 正脚; Operating Temperature Range: -65℃~+165℃
SW1 SW3-SW5 = TS-1088-AR02016: Circuit:SPST Actuator Style:Round Button Operating Force:160gf Mounting Style:Brick nogging Switch Length:4mm Switch Width:3mm Switch Height:2mm Strike Gundam:不带 Contact Current:50mA Voltage Rating (DC):12V Insulation Resistance:100MΩ Actuator/Cap Color:B; LCSC Part Name: 4*3*2mm 立贴 轻触开关; Supplier Part: C720477; Manufacturer: XUNPU(讯普); Supplier Footprint: SMD; JLCPCB Part Class: Basic Part; Datasheet: https://atta.szlcsc.com/upload/public/pdf/source/20200810/C720475_60D09DD6C54279ADDB2DC25100F1CC11.pdf; Supplier: LCSC; Circuit: SPST; Actuator Style: Round Button; Operating Force: 160gf; Mounting Style: Brick nogging; Switch Length: 4mm; Switch Width: 3mm; Switch Height: 2mm; Strike Gundam: 不带; Contact Current: 50mA; Voltage Rating (DC): 12V; Insulation Resistance: 100MΩ; Actuator/Cap Color: Black; Pin Style: SMDSplicing; Mechanical Life: 10万次; Operating Temperature: -30℃~+80℃
TP1-TP10 = Test-Point: Test Point 测试点
U1 = ESP32-S3-MINI-1-N8: Core Processor:ESP32-S3FN8 Chip Wireless Standard:- Support Interface:I2C；GPIO；SPI；PWM；ADC；UART；USB；I2S Frequency:2.4GHz Antenna Type:- Output Power:20.5dBm Output Power:20.5dBm Operating Voltage:- Operating Voltage:- Receive  Current:- Send  Current:- Se; Supplier Part: C2913206; Manufacturer: ESPRESSIF(乐鑫); Supplier Footprint: SMD; JLCPCB Part Class: Extended Part; Datasheet: https://atta.szlcsc.com/upload/public/pdf/source/20220425/7F117D7A09F85946280540FD9EFDF9F3.pdf; Supplier: LCSC; Core Processor: ESP32-S3FN8 Chip; Support Interface: I2C；GPIO；SPI；PWM；ADC；UART；USB；I2S; Output Power: 20.5dBm
U2 = E22-400M22S: Supplier Part: C411291; Manufacturer: EBYTE(亿佰特); Supplier Footprint: SMD,14.0x20mm; JLCPCB Part Class: Extended Part; Datasheet: https://atta.szlcsc.com/upload/public/pdf/source/20190812/C411291_90FD46F52AC63064ACAA22A31BCCA1DF.pdf; Supplier: LCSC
U3 = ATGM336H-5NR32: Supplier Part: C5117921; Manufacturer: 杭州中科微; Supplier Footprint: LCC-18(10.1x9.7); JLCPCB Part Class: Extended Part; Datasheet: https://atta.szlcsc.com/upload/public/pdf/source/20230625/BFC2F030748B2EE61697AE064B3C32F1.pdf; Supplier: LCSC
U4 = LY68L6400SLIT: Supplier Part: C261881; Manufacturer: Lyontek(来扬); Supplier Footprint: SOP-8; JLCPCB Part Class: Extended Part; Datasheet: https://atta.szlcsc.com/upload/public/pdf/source/20240911/02969F97DA313F70EF438339C2DAB58E.pdf; Supplier: LCSC
U5 = MPU-6500_C50278: Supplier Part: C50278; Manufacturer: TDK InvenSense(应美盛); Supplier Footprint: QFN-24-EP(3x3); JLCPCB Part Class: Extended Part; Datasheet: https://atta.szlcsc.com/upload/public/pdf/source/20170505/1493957890595.pdf; Supplier: LCSC; Sensor Type: Accelerometer gyroscope; Operating Temperature: -40℃~+85℃
U6 = TL071HIDR: LCSC Part Name: Single,40V,5MHz,4mV offset voltage,20V/us,In to V+ op amp with -40℃ to 125℃ operation; Supplier Part: C5214234; Manufacturer: TI(德州仪器); Supplier Footprint: SOIC-8; JLCPCB Part Class: Extended Part; Datasheet: https://www.ti.com/cn/lit/gpn/tl072; Supplier: LCSC
U7 = TMP102AIDRLR: Supplier Part: C99269; Manufacturer: TI(德州仪器); Supplier Footprint: SOT-563; JLCPCB Part Class: Extended Part; Datasheet: https://www.ti.com/cn/lit/gpn/tmp102; Supplier: LCSC; Temperature range: -40℃~+125℃; Resolution: ±0.5℃; Supply Voltage: 1.4V~3.6V; Standby Current: 1uA; Interface Type: I2C
U8 = LM7805S/TR: LCSC Part Name: 固定电压稳压器; Supplier Part: C507146; Manufacturer: HGSEMI(华冠); Supplier Footprint: TO-263-3; JLCPCB Part Class: Extended Part; Datasheet: https://atta.szlcsc.com/upload/public/pdf/source/20211101/54C90BF39C07253AC431AF453924CB99.pdf; Supplier: LCSC
U9 = AMS1117-3.3_C6186: LCSC Part Name: 输出3.3V 1A; Supplier Part: C6186; Manufacturer: AMS; Supplier Footprint: SOT-223; JLCPCB Part Class: Basic Part; Datasheet: https://atta.szlcsc.com/upload/public/pdf/source/20180727/C6186_7A095716F0823C02F1997A905E26C086.pdf; Supplier: LCSC; Output Type: Fixed; Voltage - Supply: 16V; Output Voltage: 3.3V; Output Current: 1A; Power Supply Rejection Ratio (PSRR): 72dB@(120Hz); Voltage Dropout: 1.1V@(800mA); standby current: 5mA; Features: Over Current Protection；Over Temperature Protection; Operating Temperature: -40℃~+125℃; Output Configuration: Positive; Number of Outputs: 1
USB1 = TYPEC-303-ACP16: LCSC Part Name: Type-C 母 立贴; Supplier Part: C720628; Manufacturer: XUNPU(讯普); Supplier Footprint: SMD; JLCPCB Part Class: Extended Part; Datasheet: https://atta.szlcsc.com/upload/public/pdf/source/20211130/923863AA03137020414D5B2211B6B11A.pdf; Supplier: LCSC; Connector Type: Type-C; Standard: USB 3.1; Gender: Female; Number of Ports: 1; Number of Contacts: 16P; Mounting Style: Brick nogging; Current Rating - Power (Max): 5A; Operating Temperature Range: -25℃~+85℃; Soldering Temperature(Max): 260℃

## Nets
3V3: C2.1 C3.2 C4.2 C7.2 C8.2 C10.2 C11.2 C15.2 C16.2 C17.1 C24.2 C25.1 C31.1 C32.1 D2.2(A) H1.4 H2.3 H4.2 H5.2 LED1.1(+) LED2.1(+) LED3.1(+) R1.2 R2.2 R14.2 R15.2 R18.2 R19.2 R22.2 R24.2 R46.2 R50.1 R51.1 TP2.1 U1.3(3V3) U2.9(VCC) U3.8(VCC) U4.8(VCC) U5.8(VDDIO) U5.13(VDD) U5.22(nCS) U6.7(VCC+) U7.5(V+) U9.2(VOUT) U9.4(VOUT)
5V: C22.2 D3.2(+) D13.2(+) D14.2(+) H1.5 TP1.1 U8.3(OUT)
12V_BLAH: D6.2(C) D11.2(+) Q2.1(S) Q2.2(S) Q2.3(S) Q3.1(S) Q3.2(S) Q3.3(S) R26.2 R38.2 R39.2
12V_IN: D6.1(A) D6.3(A) D7.2(C) P2.1
12V_LOAD: P3.1 P4.1 P5.1 P6.1 P7.1 Q3.5(D) Q3.6(D) Q3.7(D) Q3.8(D)
12V_SW: D8.2(+) Q2.5(D) Q2.6(D) Q2.7(D) Q2.8(D) TP3.1
GND: ANT1.2 BUZZER1.2 BUZZER1.3 BUZZER1.4 C1.1 C2.2 C3.1 C4.1 C5.2 C6.2 C7.1 C8.1 C10.1 C11.1 C15.1 C16.1 C17.2 C18.1 C19.1 C20.1 C21.1 C22.1 C23.1 C24.1 C25.2 C26.1 C27.1 C28.1 C29.1 C30.1 C31.2 C32.2 D1.2 D10.1(A) D10.3(A) D16.2(A) H1.1 H2.4 H4.1 H5.1 H5.5 H5.6 P1.2 P2.2 P3.2 P4.3 P5.3 P6.3 P7.3 Q1.2(E) Q5.2(S) Q6.2(S) Q7.2(S) Q8.2(S) Q9.2(E) R3.1 R4.1 R5.1 R11.1 R12.1 R16.1 R20.1 R25.1 R27.1 R29.1 R32.1 R34.1 R37.1 R40.1 R41.1 R43.1 R47.1 RF1.1(GND) RF1.2(GND) RF1.3(GND) RF2.1 RF2.2 RF2.3 RF2.4 SW1.2 U1.1(GND) U1.2(GND) U1.42(GND) U1.43(GND) U1.46(GND) U1.47(GND) U1.48(GND) U1.49(GND) U1.50(GND) U1.51(GND) U1.52(GND) U1.53(GND) U1.54(GND) U1.55(GND) U1.56(GND) U1.57(GND) U1.58(GND) U1.59(GND) U1.60(GND) U1.GND U2.1(GND) U2.2(GND) U2.3(GND) U2.4(GND) U2.5(GND) U2.10(GND) U2.11(GND) U2.12(GND) U2.20(GND) U2.22(GND) U3.1(GND) U3.10(GND) U3.12(GND) U4.4(VSS) U5.11(FSYNC) U5.18(GND) U5.20(RESV) U5.25(EP) U6.4(VCC-) U7.2(GND) U7.4(ADD0) U8.2(GND) U8.4(GND) U9.1(GND) USB1.1(GND) USB1.2(GND) USB1.3(GND) USB1.4(GND) USB1.A1(GND) USB1.A12(GND) USB1.B1(GND) USB1.B12(GND)
VBUS: D1.5 D4.2(+) D17.2(+) USB1.A4(VBUS) USB1.A9(VBUS) USB1.B4(VBUS) USB1.B9(VBUS)
ADC1: C28.2 R26.1 R27.2 U1.5(IO1)
ADC2: C29.2 R28.1 R29.2 U1.6(IO2)
ANT: R17.2 U2.21(ANT)
BATT_ON: Q5.1(G) Q8.3(D) R35.1 R36.1 R37.2 TP4.1
CHIP_EN: C1.2 R1.1 SW1.1 U1.45(EN)
ESP_POW_OFF: R33.2 U1.29(IO34)
ESP_POW_SW: R44.1 U1.28(IO33)
GPS_ON: R11.2 U3.5(ON/OFF)
GPS_PPS: R12.2 R13.1 U1.38(IO42) U3.4(1PPS)
GPS_RXD: H3.2 U3.3(RXD)
GPS_TXD: H3.1 U3.2(TXD)
HART1: H1.3 U1.19(IO15)
HART2: H1.2 U1.20(IO16)
I2C_SCL: H4.4 H5.4 R51.2 U1.22(IO18) U3.17(SCL) U5.23(SCL/SCLK) U7.1(SCL)
I2C_SDA: H4.3 H5.3 R50.2 U1.21(IO17) U3.16(SDA) U5.24(SDA/SDI) U7.6(SDA)
IMU_INT: R24.1 U1.37(IO41) U5.12(INT)
LOAD_ON: Q6.1(G) R40.2 U1.27(IO47)
LORA_BUSY: U1.17(IO13) U2.14(BUSY)
LORA_INT: R20.2 U1.18(IO14) U2.13(DIO1)
LORA_NSS: R19.1 U1.12(IO8) U2.19(NSS)
LORA_RST: R18.1 U1.16(IO12) U2.15(NRST)
MISO: U1.15(IO11) U2.16(MISO)
MOSI: U1.14(IO10) U2.17(MOSI)
POWER_SW: C18.2 D15.2(+) D16.1(K) R42.1 R43.2 R44.2 TP7.1
PSR_CE: U1.8(IO4) U4.2(SO/SIO[1])
PSR_MISO: U1.9(IO5) U4.1(CE#)
PSR_MOSI: U1.11(IO7) U4.5(SI/SIO[0])
PSR_SCK: U1.10(IO6) U4.6(SCLK)
PWM_AUDIO: C12.1 U1.30(IO48)
RGB1: P4.2 R6.2
RGB1Z: R6.1 U1.34(IO38)
RGB2: P5.2 R7.2
RGB2Z: R7.1 U1.33(IO37)
RGB3: P6.2 R8.2
RGB3Z: R8.1 U1.32(IO36)
RGB4: P7.2 R9.2
RGB4Z: R9.1 U1.31(IO35)
RXD0: H2.1 R14.1 U1.40(RXD0)
RXEN: Q9.3(C) R22.1 R23.1 TP9.1 U2.6(RXEN)
SCK: U1.13(IO9) U2.18(SCK)
SOLAR_IN: D5.1(A) D5.3(A) P1.1
SOLAR_PWM: R31.1 R32.2 U1.25(IO21)
TXD0: H2.2 R15.1 U1.39(TXD0)
TXEN: R21.2 TP10.1 U2.7(TXEN) U2.8(DIO2)
USB_N: D1.6 U1.23(IO19)
USB_NZ: D1.1 USB1.A7(DN1) USB1.B7(DN2)
USB_P: D1.4 U1.24(IO20)
USB_PZ: D1.3 USB1.A6(DP1) USB1.B6(DP2)
V_SOLAR: D5.2(C) D9.2(+) D12.2(+) Q4.1(S) Q4.2(S) Q4.3(S) R28.2 R30.2
$1N4230: R4.2 USB1.B8(SBU2)
$1N4235: R5.2 USB1.A8(SBU1)
$1N5068: C5.1 C6.1 D2.1(K) U3.6(VBAT)
$1N5476: Q1.1(B) R13.2
$1N5630: Q1.3(C) R10.1
$1N5669: LED1.2(-) R10.2
$1N6709: L2.2 U3.14(VCC_RF)
$1N6717: C9.2 L2.1 R45.1 U3.11(RF_IN)
$1N6857: R45.2 RF1.4(SIG)
$1N6929: ANT1.1 C9.1
$1N7141: C13.2 C14.1 U6.2(IN-) U6.6(OUT)
$1N7143: BUZZER1.1(+) C14.2
$1N7407: C27.2 R49.1 U6.3(IN+)
$1N7412: C13.1 R48.2 R49.2
$1N7418: C12.2 R46.1 R47.2 R48.1
$1N15871: Q2.4(G) Q5.3(D) R38.1
$1N23223: R3.2 SW3.2
$1N23234: SW3.1 U1.4(IO0)
$1N26209: R17.1 RF2.5
$1N26688: TP8.1 U1.44(IO46)
$1N27231: Q9.1(B) R21.1
$1N27414: LED2.2(-) R23.2
$1N28291: R25.2 U5.9(SDO/AD0)
$1N28343: C30.2 U5.10(REGOUT)
$1N28865: Q3.4(G) Q6.3(D) R39.1
$1N29217: Q4.4(G) Q7.3(D) R30.1
$1N29863: C23.2 D3.1(-) D4.1(-) U9.3(VIN)
$1N30566: C21.2 D8.1(-) D9.1(-) U8.1(VCC)
$1N33728: C20.2 D7.1(A) D7.3(A) L1.2
$1N33737: C19.2 D10.2(C) L1.1 Q4.5(D) Q4.6(D) Q4.7(D) Q4.8(D)
$1N34431: Q7.1(G) R31.2
$1N34822: D11.1(-) D12.1(-) D13.1(-) D17.1(-) SW4.2 SW5.2 TP5.1
$1N35006: R42.2 SW4.1 SW5.1 TP6.1
$1N35994: D14.1(-) R35.2
$1N36208: D15.1(-) R36.2
$1N36518: C26.2 Q8.1(G) R33.1 R34.2
$1N37546: LED3.2(-) R41.2
$1N37666: LED4.2(-) R16.2
$1N37670: LED4.1(+) U1.36(IO40)
$1N37708: R2.1 U1.7(IO3)

Not connected (* = marked no-connect by the designer): U1 26(IO26)* 35(IO39)* 41(IO45)*; U3 7(NC)* 9(nRESET)* 13(NC)* 15(Reserved)* 18(Reserved)*; U4 3(SIO[2])* 7(SIO[3])*; U5 1(NC)* 2(NC)* 3(NC)* 4(NC)* 5(NC)* 6(NC)* 7(AUX_CL)* 14(NC)* 15(NC)* 16(NC)* 17(NC)* 19(RESV)* 21(AUX_DA)*; U7 3(ALERT)*; USB1 A5(CC1)* B5(CC2)*

## Notes on the sheet
- ESP32-S3
- LoRa
- Serial
- ESP
- GPS
- PSRAM
- Hartmann
  Standard
  Connector
- USB-C
- Qwiic
- I2C
- Solar
- 12V Power
- Addressable LED Outputs
- Load Power
- GPS
- ADC Stuff
- 3.3V Supply
- Temperature
- 5V Supply
- Power Button
- IMU
- Audio Out
